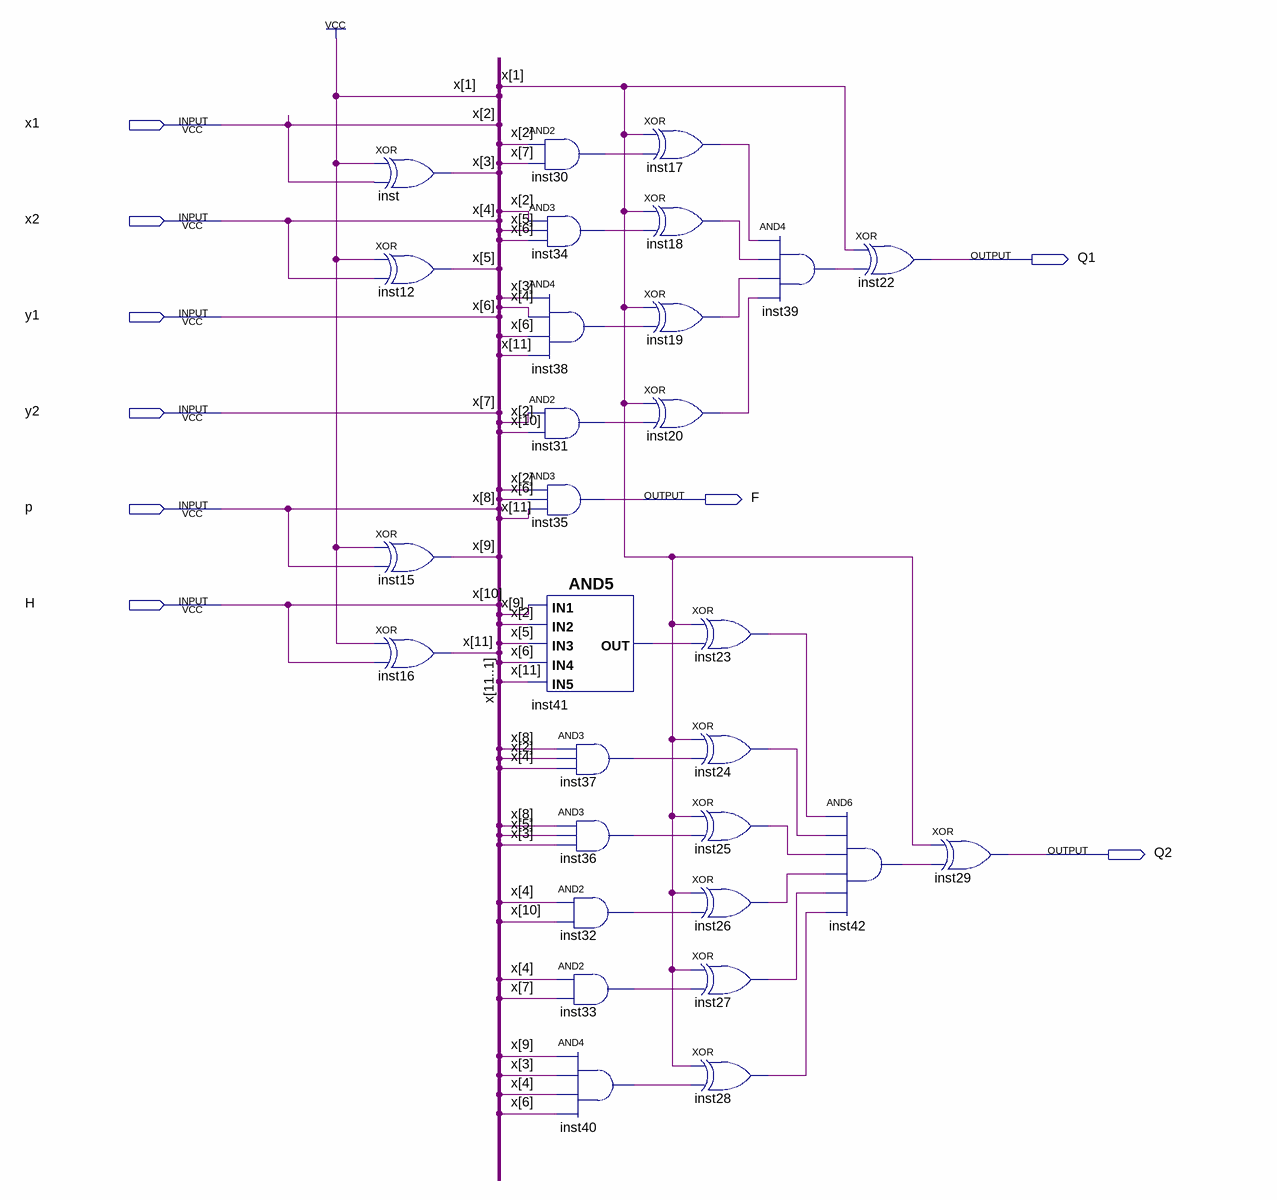
[diagram p0: schematic sheet]
// Quartus schematic kursach.bdf as structural Verilog: 29 symbols, 9 pins
module kursach (
  input  x1,
  input  x2,
  input  y1,
  input  y2,
  input  p,
  input  H,
  output Q1,
  output F,
  output Q2
);

  wire inst17_out, inst18_out, inst19_out, inst20_out, inst23_out, inst24_out, inst25_out, inst26_out,
       inst27_out, inst28_out, inst30_out, inst31_out, inst32_out, inst33_out, inst34_out, inst36_out,
       inst37_out, inst38_out, inst39_out, inst40_out, inst41_out, inst42_out;
  wire [11:3] x;

  xor inst (x[3], x1, x1);
  xor inst12 (x[5], x1, x2);
  xor inst15 (x[9], x1, p);
  xor inst16 (x[11], x1, H);
  and inst30 (inst30_out, x1, y2);
  and inst34 (inst34_out, x1, x[5], y1);
  and inst38 (inst38_out, x[3], x2, y1, x[11]);
  and inst31 (inst31_out, x1, H);
  and inst35 (F, x1, y1, x[11]);
  and inst41 (inst41_out, x[9], x1, x[5], y1, x[11]);
  and inst37 (inst37_out, p, x1, x2);
  and inst36 (inst36_out, p, x[5], x[3]);
  and inst32 (inst32_out, x2, H);
  and inst33 (inst33_out, x2, y2);
  and inst40 (inst40_out, x[9], x[3], x2, y1);
  xor inst17 (inst17_out, x1, inst30_out);
  xor inst18 (inst18_out, x1, inst34_out);
  xor inst19 (inst19_out, x1, inst38_out);
  xor inst20 (inst20_out, x1, inst31_out);
  xor inst23 (inst23_out, x1, inst41_out);
  xor inst24 (inst24_out, x1, inst37_out);
  xor inst25 (inst25_out, x1, inst36_out);
  xor inst26 (inst26_out, x1, inst32_out);
  xor inst27 (inst27_out, x1, inst33_out);
  xor inst28 (inst28_out, x1, inst40_out);
  and inst39 (inst39_out, inst17_out, inst18_out, inst19_out, inst20_out);
  xor inst22 (Q1, x1, inst39_out);
  and inst42 (inst42_out, inst23_out, inst24_out, inst25_out, inst26_out, inst27_out, inst28_out);
  xor inst29 (Q2, x1, inst42_out);
  // also tied to VCC on the sheet: x1

  // Other names for the same wires on the sheet: x (some bits) = {H, p, y2, y1, x2, x1}
endmodule
